# EAGLE design schematic (EAGLE 9.5.1)
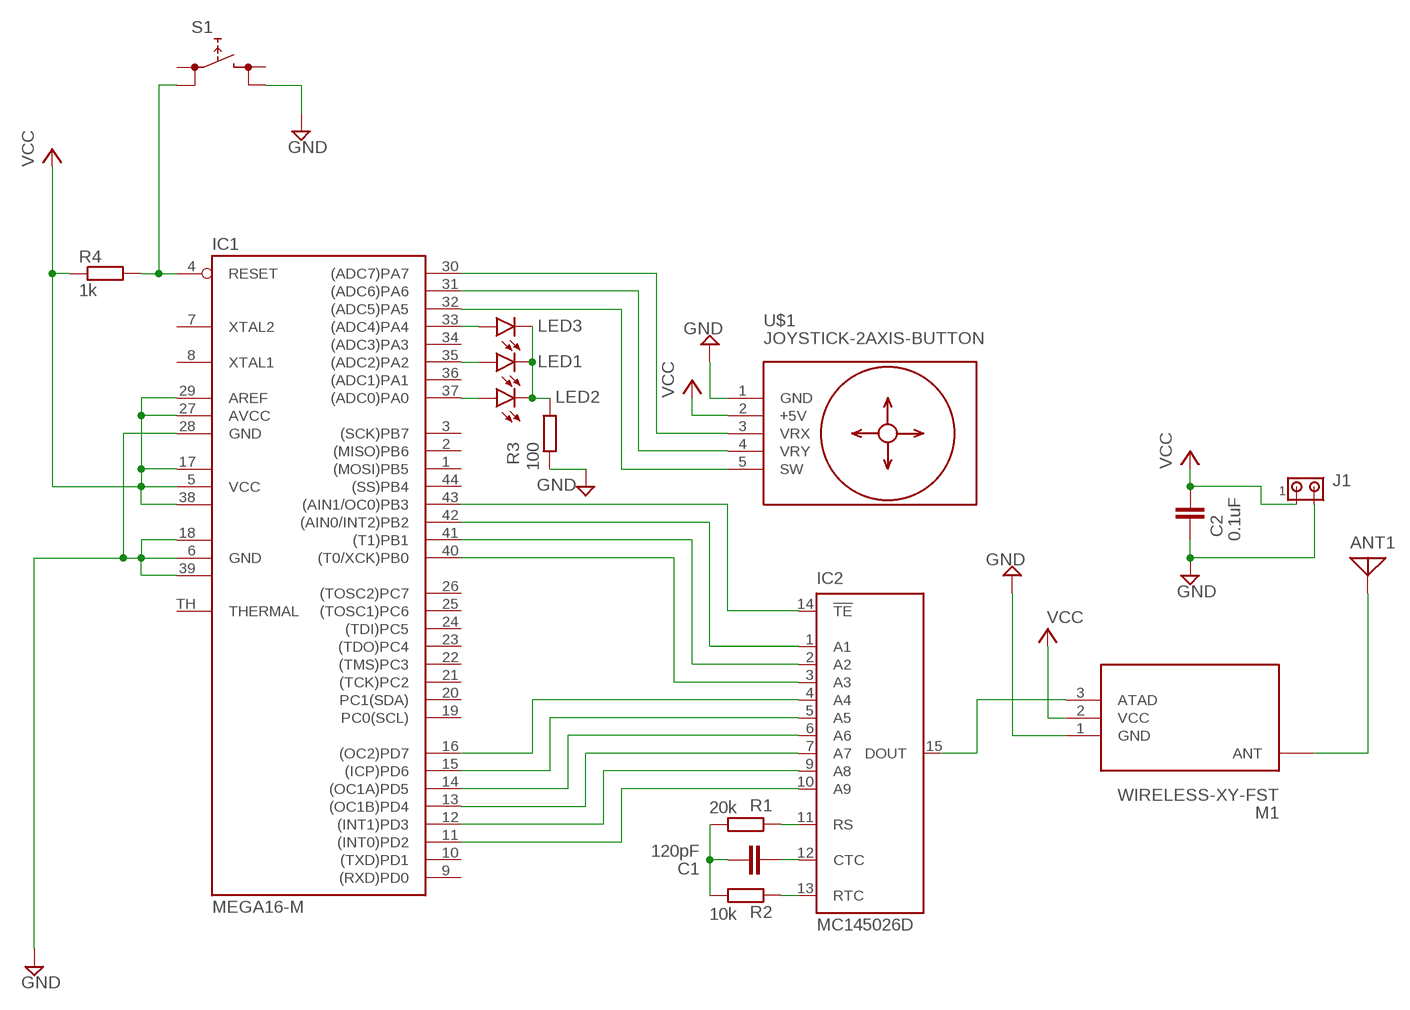
[diagram p0: schematic, sheet 1]

## Parts
ANT1  ANTENNA  [PAD-01]
C1  120pF  C2,5-3  [C2.5-3]
C2  0.1uF  C2,5-3  [C2.5-3]
IC1  MEGA16-M  [MLF44-TH]
IC2  MC145026D  [SO16]
J1  MTA02-100  [10X02MTA]
LED1  LEDCHIPLED_1206  [CHIPLED_1206]
LED2  LEDCHIPLED_1206  [CHIPLED_1206]
LED3  LEDCHIPLED_1206  [CHIPLED_1206]
M1  WIRELESS-XY-FST  [WIRELESS-XY-FST]
R1  20k  R-EU_M0805  [M0805]
R2  10k  R-EU_R0805  [R0805]
R3  100  R-EU_M0805  [M0805]
R4  1k  R-EU_R0805  [R0805]
S1  REKN  [REKN]
U$1  JOYSTICK-2AXIS-BUTTON  [JOYSTICK-2AXIS-BUTTON]

## Nets
GND: C2.1 IC1.6(GND) IC1.18(GND1) IC1.28(GND) IC1.39(GND2) J1.2 M1.1(GND) R3.2 S1.1B U$1.1(GND)
N$1: IC1.30((ADC7)PA7) U$1.3(VRX)
N$2: IC1.31((ADC6)PA6) U$1.4(VRY)
N$3: IC1.32((ADC5)PA5) U$1.5(SW)
N$4: IC2.11(RS) R1.1
N$5: C1.2 IC2.12(CTC)
N$6: IC2.13(RTC) R2.1
N$7: C1.1 R1.2 R2.2
N$8: IC2.15(DOUT) M1.3(ATAD)
N$9: ANT1.1 M1.ANT
N$10: IC1.13((OC1B)PD4) IC2.7(A7)
N$11: IC1.14((OC1A)PD5) IC2.6(A6)
N$12: IC1.15((ICP)PD6) IC2.5(A5)
N$13: IC1.11((INT0)PD2) IC2.10(A9)
N$14: IC1.12((INT1)PD3) IC2.9(A8)
N$15: IC1.16((OC2)PD7) IC2.4(A4)
N$16: IC1.4(RESET) R4.2 S1.0B
N$17: IC1.43((AIN1/OC0)PB3) IC2.14(!TE)
N$18: IC1.42((AIN0/INT2)PB2) IC2.1(A1)
N$19: IC1.41((T1)PB1) IC2.2(A2)
N$20: IC1.40((T0/XCK)PB0) IC2.3(A3)
N$22: IC1.33((ADC4)PA4) LED3.A
N$23: IC1.35((ADC2)PA2) LED1.A
N$24: IC1.37((ADC0)PA0) LED2.A
N$25: LED1.C LED2.C LED3.C R3.1
VCC: C2.2 IC1.5(VCC) IC1.17(VCC1) IC1.27(AVCC) IC1.29(AREF) IC1.38(VCC2) J1.1 M1.2(VCC) R4.1 U$1.2(+5V)
Unconnected: IC1.1((MOSI)PB5) IC1.2((MISO)PB6) IC1.3((SCK)PB7) IC1.7(XTAL2) IC1.8(XTAL1) IC1.9((RXD)PD0) IC1.10((TXD)PD1) IC1.19(PC0(SCL)) IC1.20(PC1(SDA)) IC1.21((TCK)PC2) IC1.22((TMS)PC3) IC1.23((TDO)PC4) IC1.24((TDI)PC5) IC1.25((TOSC1)PC6) IC1.26((TOSC2)PC7) IC1.34((ADC3)PA3) IC1.36((ADC1)PA1) IC1.44((SS)PB4) IC1.TH(THERMAL) S1.0A S1.1A

## Power pins joined to a net without a drawn wire
VDD: IC2.16(VDD)
VSS: IC2.8(VSS)

## Library data of the parts
ANT1 = discrete:ANTENNA: Antenna
C1 C2 = capacitor-wima:C: CAPACITOR naming: grid - package width
IC1 = atmel:MEGA16-M: MICROCONTROLLER 16 Kbytes FLASH 1 kbytes SRAM 512 bytes EEPROM USART 8-channel 10 bit ADC Source: avr.lbr; MPN: ATMEGA16-16MU; OC_FARNELL: 1455097; OC_NEWARK: 58M3723; SPICEPREFIX: X
IC2 = micro-motorola:MC145026: ENCODER; OC_FARNELL: unknown; OC_NEWARK: unknown
J1 = con-amp:MTA02-100: AMP connector
LED1-LED3 = led:LED: LED OSRAM: - CHIPLED LG R971, LG N971, LY N971, LG Q971, LY Q971, LO R971, LY R971 LH N974, LH R974 LS Q976, LO Q976, LY Q976 LO Q996 - Hyper CHIPLED LW Q18S LB Q993, LB Q99A, LB R99A - SideLED LS A670, LO A670, LY A670, LG A670, LP A670 LB A673, LV A673, LT A673, LW A673 LH A674 LY A675 LS A676, LA A676, LO A676, LY A676, LW A676 LS A679, LY A679, LG A679 - Hyper Micro SIDELED® LS Y876, LA Y876, LO Y876, LY Y876 LT Y87S - SmartLED LW L88C, LW L88S LB L89C, LB L89S, LG L890 LS L89K, LO L89K, LY L89K LS L896, LA L896, LO L896, LY L896 - TOPLED LS T670, LO T670, LY T670, LG T670, LP T670 LSG T670, LSP T670, LSY T670, LOP T670, LYG T670 LG T671, LOG T671, LSG T671 LB T673, LV T673, LT T673, LW T673 LH T674 LS T676, LA T676, LO T676, LY T676, LB T676, LH T676, LSB T676, LW T676 LB T67C, LV T67C, LT T67C, LS T67K, LO T67K, LY T67K, LW E67C LS E67B, LA E67B, LO E67B, LY E67B, LB E67C, LV E67C, LT E67C LW T67C LS T679, LY T679, LG T679 LS T770, LO T770, LY T770, LG T770, LP T770 LB T773, LV T773, LT T773, LW T773 LH T774 LS E675, LA E675, LY E675, LS T675 LS T776, LA T776, LO T776, LY T776, LB T776 LHGB T686 LT T68C, LB T68C - Hyper Mini TOPLED® LB M676 - Mini TOPLED Santana® LG M470 LS M47K, LO M47K, LY M47K Source: http://www.osram.convergy.de LUXEON: - LUMILED® LXK2-PW12-R00, LXK2-PW12-S00, LXK2-PW14-U00, LXK2-PW14-V00 LXK2-PM12-R00, LXK2-PM12-S00, LXK2-PM14-U00 LXK2-PE12-Q00, LXK2-PE12-R00, LXK2-PE12-S00, LXK2-PE14-T00, LXK2-PE14-U00 LXK2-PB12-K00, LXK2-PB12-L00, LXK2-PB12-M00, LXK2-PB14-N00, LXK2-PB14-P00, LXK2-PB14-Q00 LXK2-PR12-L00, LXK2-PR12-M00, LXK2-PR14-Q00, LXK2-PR14-R00 LXK2-PD12-Q00, LXK2-PD12-R00, LXK2-PD12-S00 LXK2-PH12-R00, LXK2-PH12-S00 LXK2-PL12-P00, LXK2-PL12-Q00, LXK2-PL12-R00 Source: www.luxeon.com KINGBRIGHT: KA-3528ASYC Source: www.kingbright.com
M1 = diy-modules:WIRELESS-XY-FST: RF Wireless XY-FST Transmitter Click here to find device on ebay.com <http://www.ebay.com/sch/xd+fst+transmitter> Note: Sold together with receiver.
R1-R4 = rcl:R-EU_: RESISTOR, European symbol; SPICEPREFIX: R
S1 = switch:REKN: PUSH SWITCH ITT-Cannon-Cannon
U$1 = diy-modules:JOYSTICK-2AXIS-BUTTON: 2-Axis Analog Joystick with Push Button Tutorial is available here: http://henrysbench.capnfatz.com/henrys-bench/arduino-sensors-and-input/arduino-ps2-joystick-tutorial-keyes-ky-023-deek-robot/ Click here to find device on ebay.com <http://www.ebay.com/sch/joystick+ps2+module>

## Board
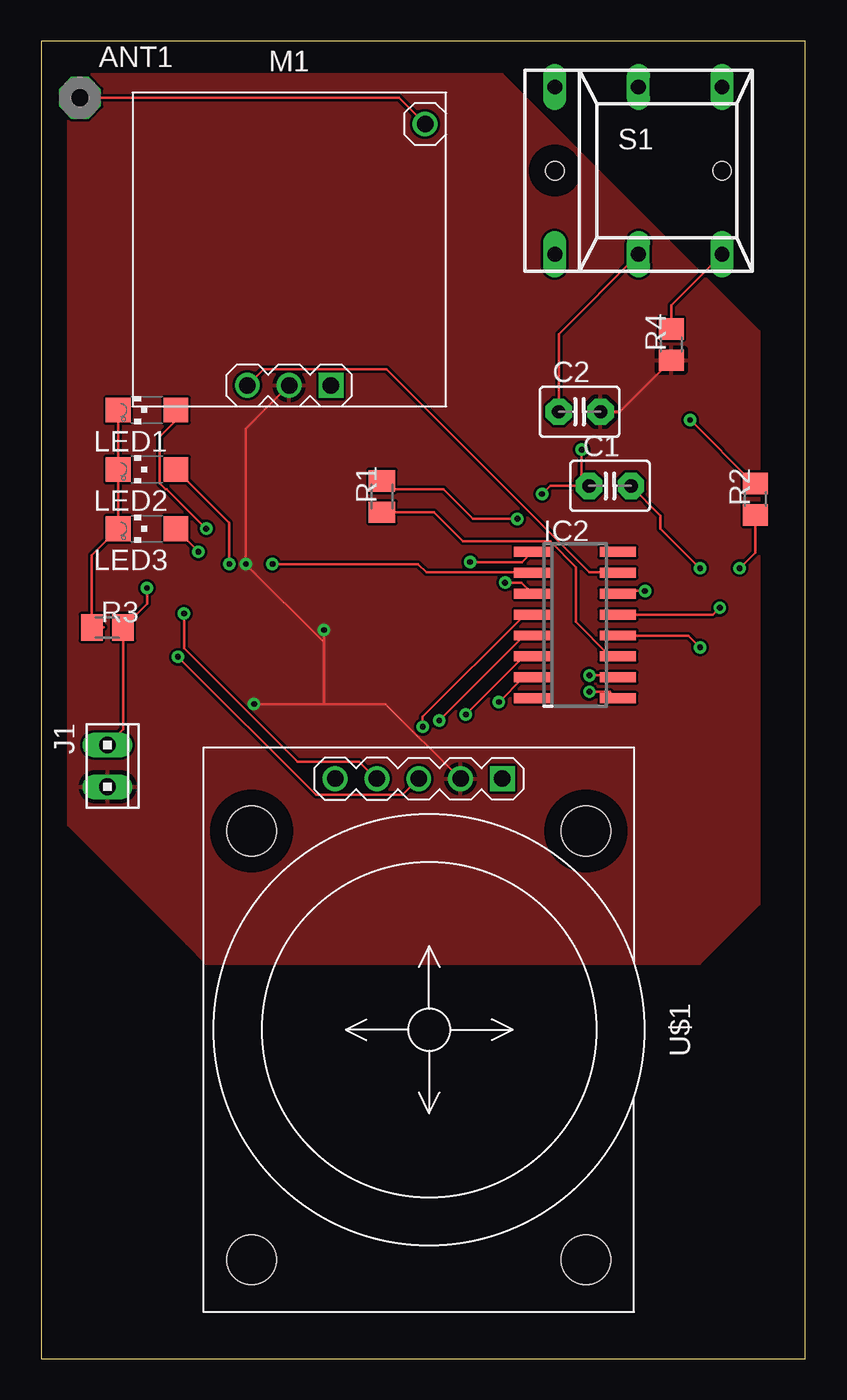
[diagram p1: board, top side]
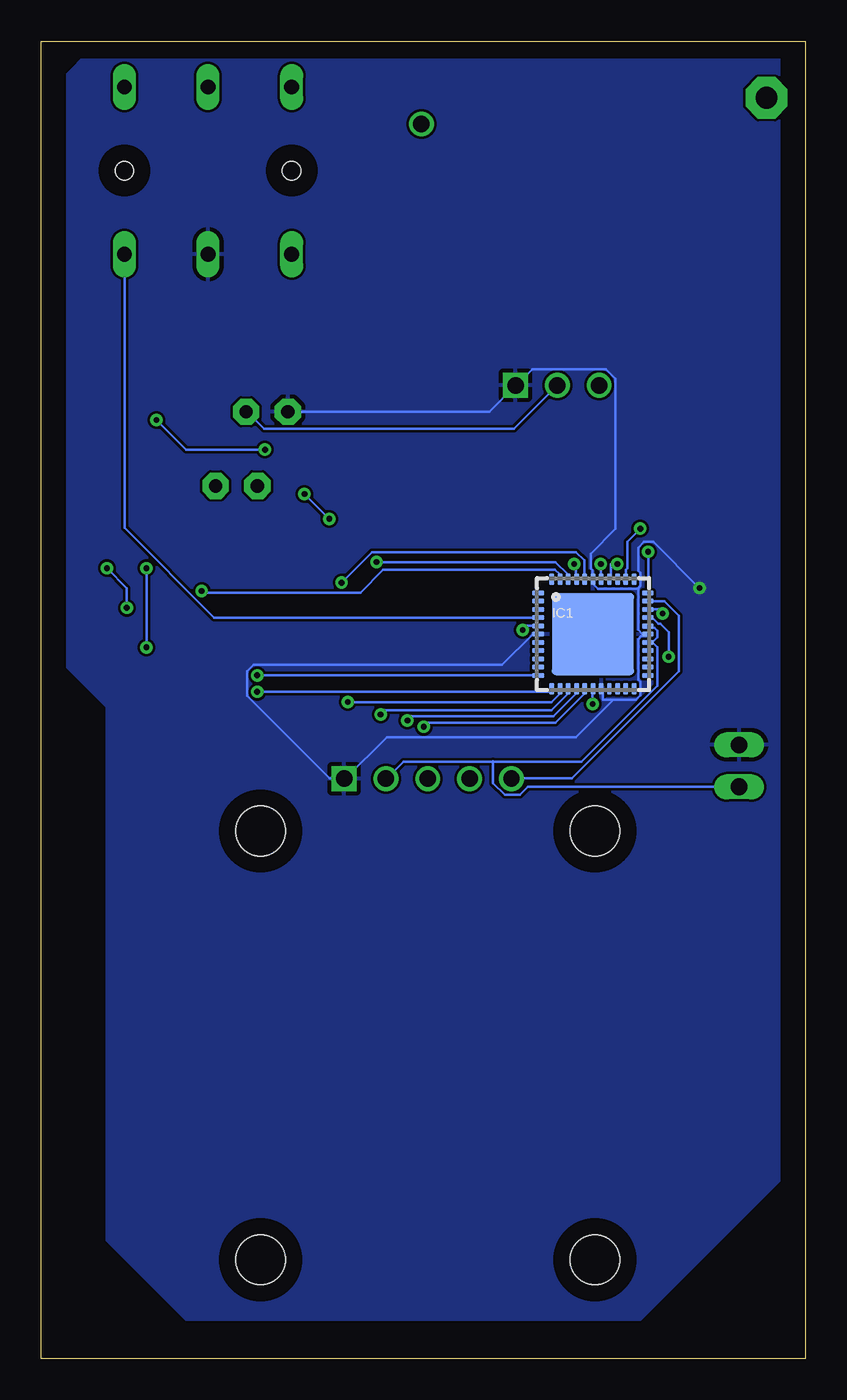
[diagram p2: board, bottom side, seen from below]

Size 46.43 x 80 mm. Coordinates in mm from the lower left corner, seen from the top.
Outline: 0,0 46.43,0 46.43,80 0,80 0,0
Copper layers (1*16): Top 0.035mm / dielectric 1.5mm / Bottom 0.035mm
Design rules "default": minimum track width 6mil, minimum drill 0.35mm, track to track 6mil, track to pad 6mil, pad to pad 6mil, via to via 6mil, smd to smd 6mil, copper to edge 40mil, drill to drill 6mil, minimum pad ring 10mil, minimum via ring 8mil, stop-mask expansion 4mil, vias tented up to drill 0mil, thermal gap 10mil

### Footprints (pad centres in the part's own frame; a part is rotated, then mirrored left to right if it is on the bottom)
PAD-01 = drill 1.321 pad 2.54 octagon: 1 0,0
C2.5-3 = drill 0.813 pad 1.6 octagon: 1 -1.27,0; 2 1.27,0
MLF44-TH = smd 0.7 x 0.3: 1 -3.325,2.5; 2 -3.325,2; 3 -3.325,1.5; 4 -3.325,1; 5 -3.325,0.5; 6 -3.325,0; 7 -3.325,-0.5; 8 -3.325,-1; 9 -3.325,-1.5; 10 -3.325,-2; 11 -3.325,-2.5; 23 3.325,-2.5; 24 3.325,-2; 25 3.325,-1.5; 26 3.325,-1; 27 3.325,-0.5; 28 3.325,0; 29 3.325,0.5; 30 3.325,1; 31 3.325,1.5; 32 3.325,2; 33 3.325,2.5 | smd 0.3 x 0.7: 12 -2.5,-3.325; 13 -2,-3.325; 14 -1.5,-3.325; 15 -1,-3.325; 16 -0.5,-3.325; 17 0,-3.325; 18 0.5,-3.325; 19 1,-3.325; 20 1.5,-3.325; 21 2,-3.325; 22 2.5,-3.325; 34 2.5,3.325; 35 2,3.325; 36 1.5,3.325; 37 1,3.325; 38 0.5,3.325; 39 0,3.325; 40 -0.5,3.325; 41 -1,3.325; 42 -1.5,3.325; 43 -2,3.325; 44 -2.5,3.325 | smd 5 x 5: TH 0,0
SO16 = smd 0.6 x 2.2: 1 -4.445,-2.6; 2 -3.175,-2.6; 3 -1.905,-2.6; 4 -0.635,-2.6; 5 0.635,-2.6; 6 1.905,-2.6; 7 3.175,-2.6; 8 4.445,-2.6; 9 4.445,2.6; 10 3.175,2.6; 11 1.905,2.6; 12 0.635,2.6; 13 -0.635,2.6; 14 -1.905,2.6; 15 -3.175,2.6; 16 -4.445,2.6
10X02MTA = drill 1.016 long: 1 1.27,0; 2 -1.27,0
CHIPLED_1206 = smd 1.5 x 1.5: A 0,-1.75; C 0,1.75
WIRELESS-XY-FST = drill 1 square: 1 2.54,-8.89 | drill 1: 2 0,-8.89; 3 -2.54,-8.89; ANT 8.255,6.985
M0805 = smd 1.3 x 1.6: 1 -0.95,0; 2 0.95,0
R0805 = smd 1.3 x 1.5: 1 -0.95,0; 2 0.95,0
REKN = drill 0.9 long: 0A 5.08,5.08; 0B 5.08,-5.08; 1A 0,5.08; 1B 0,-5.08; A -5.08,5.08; B -5.08,-5.08 | hole 1.1: -5.08,0; 5.08,0
JOYSTICK-2AXIS-BUTTON = drill 1 square: 1 -15.24,5.08 | drill 1: 2 -15.24,2.54; 3 -15.24,0; 4 -15.24,-2.54; 5 -15.24,-5.08 | hole 3: -12.065,10.16; -12.065,-10.16; 13.97,-10.16; 13.97,10.16

### Placement (x,y rotation side)
ANT1  2.36,76.56 0 top
C1  34.56,53 0 top
C2  32.71,57.5 0 top
IC1  12.91,44 0 bottom
IC2  32.43,44.55 270 top
J1  4.03,36 270 top
LED1  6.43,57.6 90 top
LED2  6.43,54 90 top
LED3  6.43,50.4 90 top
M1  15.07,67.99 0 top
R1  20.7,52.35 90 top
R2  43.38,52.19 90 top
R3  4.03,44.4 0 top
R4  38.28,61.58 90 top
S1  36.29,72.14 0 top
U$1  22.94,19.98 270 top

### Tracks (layer width: path | path; a pad name or v marks a point on that pad's centre or on a via)
GND  (via drill 0.35)
  Top 0.152: J1.2 4.98,38.22 R3.2 6.43,45.85 v6.43,46.8 | S1.1B 31.44,62.21 C2.1
  Bottom 0.152: IC1.6 16.55,44 18.43,42.12 33.54,42.12 33.91,41.75 33.91,40.25 28.91,35.25 28.05,35.25 U$1.1 27.96,35.22 25.43,37.75 13.93,37.75 11.68,40 | 11.68,40 12.3,40 12.3,40.62 IC1.18 | 10.16,46.7 10.16,44.25 9.91,44 IC1.28 9.71,43.88 9.99,43.88 10.16,43.7 10.16,41.23 10.03,41.1 10.03,40.27 10.31,40 11.68,40 | 10.16,46.7 10.21,46.75 12.61,46.75 12.91,47.05 IC1.39 12.93,47.34 12.93,47.88 13.04,47.98 13.04,48.89 11.55,50.38 11.55,59.51 12.12,60.08 16.6,60.08 17.58,59.1 M1.1 19.21,57.5 C2.1 | 10.16,46.7 10.16,46.79 10.03,46.92 10.03,47.73 10.16,47.86 10.16,49.25 9.81,49.61 9.24,49.61 v6.43,46.8
  pour Bottom (rank 6): 1.63,79.2 1.63,10.8 10.03,2.4 37.63,2.4 42.43,7.2 42.43,39.6 44.83,42 44.83,78 43.63,79.2
N$1  (via drill 0.35)
  Top 0.152: U$1.3 21.96,34.24 16.69,34.24 v8.3,42.62
  Bottom 0.152: IC1.30 9.3,45 8.93,44.62 8.8,44.62 8.3,44.12 v8.3,42.62
N$2  (via drill 0.35)
  Top 0.152: U$1.4 20.34,35.22 19.3,36.25 15.57,36.25 8.68,43.14 v8.68,45.25
  Bottom 0.152: IC1.31 8.93,45.5 v8.68,45.25
N$3
  Bottom 0.152: U$1.5 17.83,35.25 14.19,35.25 7.7,41.74 7.7,45.13 8.57,46 IC1.32
N$4
  Top 0.152: R1.1 23.85,51.4 25.63,49.62 30.92,49.62 32.48,48.07 32.48,44.74 34.47,42.75 34.93,42.75 IC2.11
N$5  (via drill 0.35)
  Top 0.152: C1.2 37.63,51.2 37.63,50.4 v40.03,48 | v40.03,43.2 39.32,43.91 IC2.12
  Bottom 0.152: v40.03,43.2 v40.03,48
N$6  (via drill 0.35)
  Top 0.152: 35.05,45.25 IC2.13 40.82,45.19 v41.23,45.6 | 43.38,51.19 R2.1 43.38,48.95 v42.43,48
  Bottom 0.152: v41.23,45.6 41.23,46.8 v42.43,48
N$7  (via drill 0.35)
  Top 0.152: C1.1 32.83,53 | 32.83,53 30.93,53 v30.43,52.5 | v32.83,55.2 32.83,53 | R1.2 21.2,52.8 24.43,52.8 26.23,51 v28.93,51 | R2.2 43.29,53.14 v39.43,57
  Bottom 0.152: v28.93,51 v30.43,52.5 | v39.43,57 37.63,55.2 v32.83,55.2
N$8
  Top 0.152: IC2.15 35.01,47.75 33.3,47.75 20.97,60.08 13.51,60.08 M1.3
N$9
  Top 0.152: M1.ANT 21.74,76.56 ANT1.1
N$10  (via drill 0.35)
  Top 0.152: v27.8,39.88 29.3,41.38 IC2.7
  Bottom 0.152: IC1.13 14.93,40.66 14.93,40.38 15.43,39.88 v27.8,39.88
N$11  (via drill 0.35)
  Top 0.152: v25.8,39.12 29.3,42.62 29.81,42.62 IC2.6
  Bottom 0.152: v25.8,39.12 25.55,39.38 15.43,39.38 14.43,40.38 14.43,40.66 IC1.14
N$12  (via drill 0.35)
  Top 0.152: v24.18,38.75 29.3,43.88 29.79,43.88 IC2.5
  Bottom 0.152: v24.18,38.75 23.93,39 15.31,39 13.93,40.38 13.93,40.66 IC1.15
N$13  (via drill 0.35)
  Top 0.152: v33.3,41.5 34.8,41.5 34.93,41.38 IC2.10
  Bottom 0.152: v33.3,41.5 IC1.11
N$14  (via drill 0.35)
  Top 0.152: v33.3,40.5 34.55,40.5 34.93,40.12 IC2.9
  Bottom 0.152: v33.3,40.5 15.59,40.5 IC1.12
N$15  (via drill 0.35)
  Top 0.152: IC2.4 29.77,45.12 29.32,45.12 23.18,38.99 v23.18,38.38
  Bottom 0.152: v23.18,38.38 22.93,38.62 15.18,38.62 13.43,40.38 13.43,40.66 IC1.16
N$16
  Top 0.152: 41.3,67 S1.0B 38.28,63.97 R4.2
  Bottom 0.152: S1.0B 41.37,50.46 35.91,45 IC1.4
N$17  (via drill 0.35)
  Top 0.152: v36.68,46.62 35.18,46.62 35.05,46.5 IC2.14
  Bottom 0.152: IC1.43 14.93,47.34 14.93,47.62 15.21,47.9 25.65,47.9 27.04,46.52 36.57,46.52 v36.68,46.62
N$18  (via drill 0.35)
  Top 0.152: IC2.1 29.21,48.38 v26.05,48.38
  Bottom 0.152: IC1.42 14.43,47.34 14.43,47.62 15.18,48.38 v26.05,48.38
N$19  (via drill 0.35)
  Top 0.152: v14.05,48.25 22.9,48.25 23.4,47.75 29.8,47.75 IC2.2
  Bottom 0.152: v14.05,48.25 13.93,48.25 13.93,47.38 IC1.41
N$20  (via drill 0.35)
  Top 0.152: v28.18,47.12 29.18,47.12 29.8,46.5 IC2.3
  Bottom 0.152: IC1.40 13.43,47.34 13.43,48.48 13.93,48.98 26.32,48.98 v28.18,47.12
N$22  (via drill 0.35)
  Top 0.152: v9.55,49 8.18,50.38 LED3.A
  Bottom 0.152: v9.55,49 9.55,46.5 IC1.33
N$23  (via drill 0.35)
  Top 0.152: LED1.A 8.18,56.95 7.2,55.97 7.2,53.16 7.56,52.8 7.63,52.8 v10.03,50.4
  Bottom 0.152: 11.03,47.2 IC1.35 10.91,47.91 10.82,48 10.82,49.61 v10.03,50.4
N$24  (via drill 0.35)
  Top 0.152: v11.43,48.25 11.43,50.75 LED2.A
  Bottom 0.152: v11.43,48.25 11.8,48.25 11.8,47.38 IC1.37
N$25
  Top 0.152: LED1.C LED2.C LED3.C | 3.8,44.42 R3.1 3.08,48.8 LED3.C | 4.68,50.38 LED3.C
VCC  (via drill 0.35)
  Top 0.152: 17.18,39.75 20.93,39.75 25.46,35.22 U$1.2 | 17.18,39.75 v12.93,39.75 | 17.18,39.75 17.18,43.5 | 17.18,43.5 v17.18,44.25 | 17.18,43.5 v12.43,48.25 12.43,56.46 M1.2 | R4.1 35.15,57.5 C2.2
  Bottom 0.152: 9.3,43.5 IC1.27 9.55,43.5 | v12.93,39.75 12.93,40.62 IC1.17 | IC1.5 16.93,44.5 v17.18,44.25 | v12.43,48.25 12.43,47.38 IC1.38 | 18.97,36.25 24.43,36.25 25.43,35.25 U$1.2 | C2.2 33.93,57.5 32.9,56.47 17.71,56.47 M1.2 | IC1.29 9.71,44.38 | 9.71,44.38 9.86,44.38 | 9.71,44.38 9.18,44.38 9.01,44.2 9.01,43.8 9.3,43.5 | 18.97,36.27 18.97,36.25 | 9.3,43.5 9.01,43.2 9.01,40.87 13.62,36.25 18.97,36.25 | 18.97,36.25 18.97,34.94 18.27,34.24 17.35,34.24 16.86,34.73 J1.1
  pour Top (rank 6): 1.63,78 1.63,32.4 8.83,25.2 10.03,24 40.03,24 43.63,27.6 43.63,62.4 28.03,78